# EAGLE design cc2652p2-tcp (EAGLE 9.6.2)
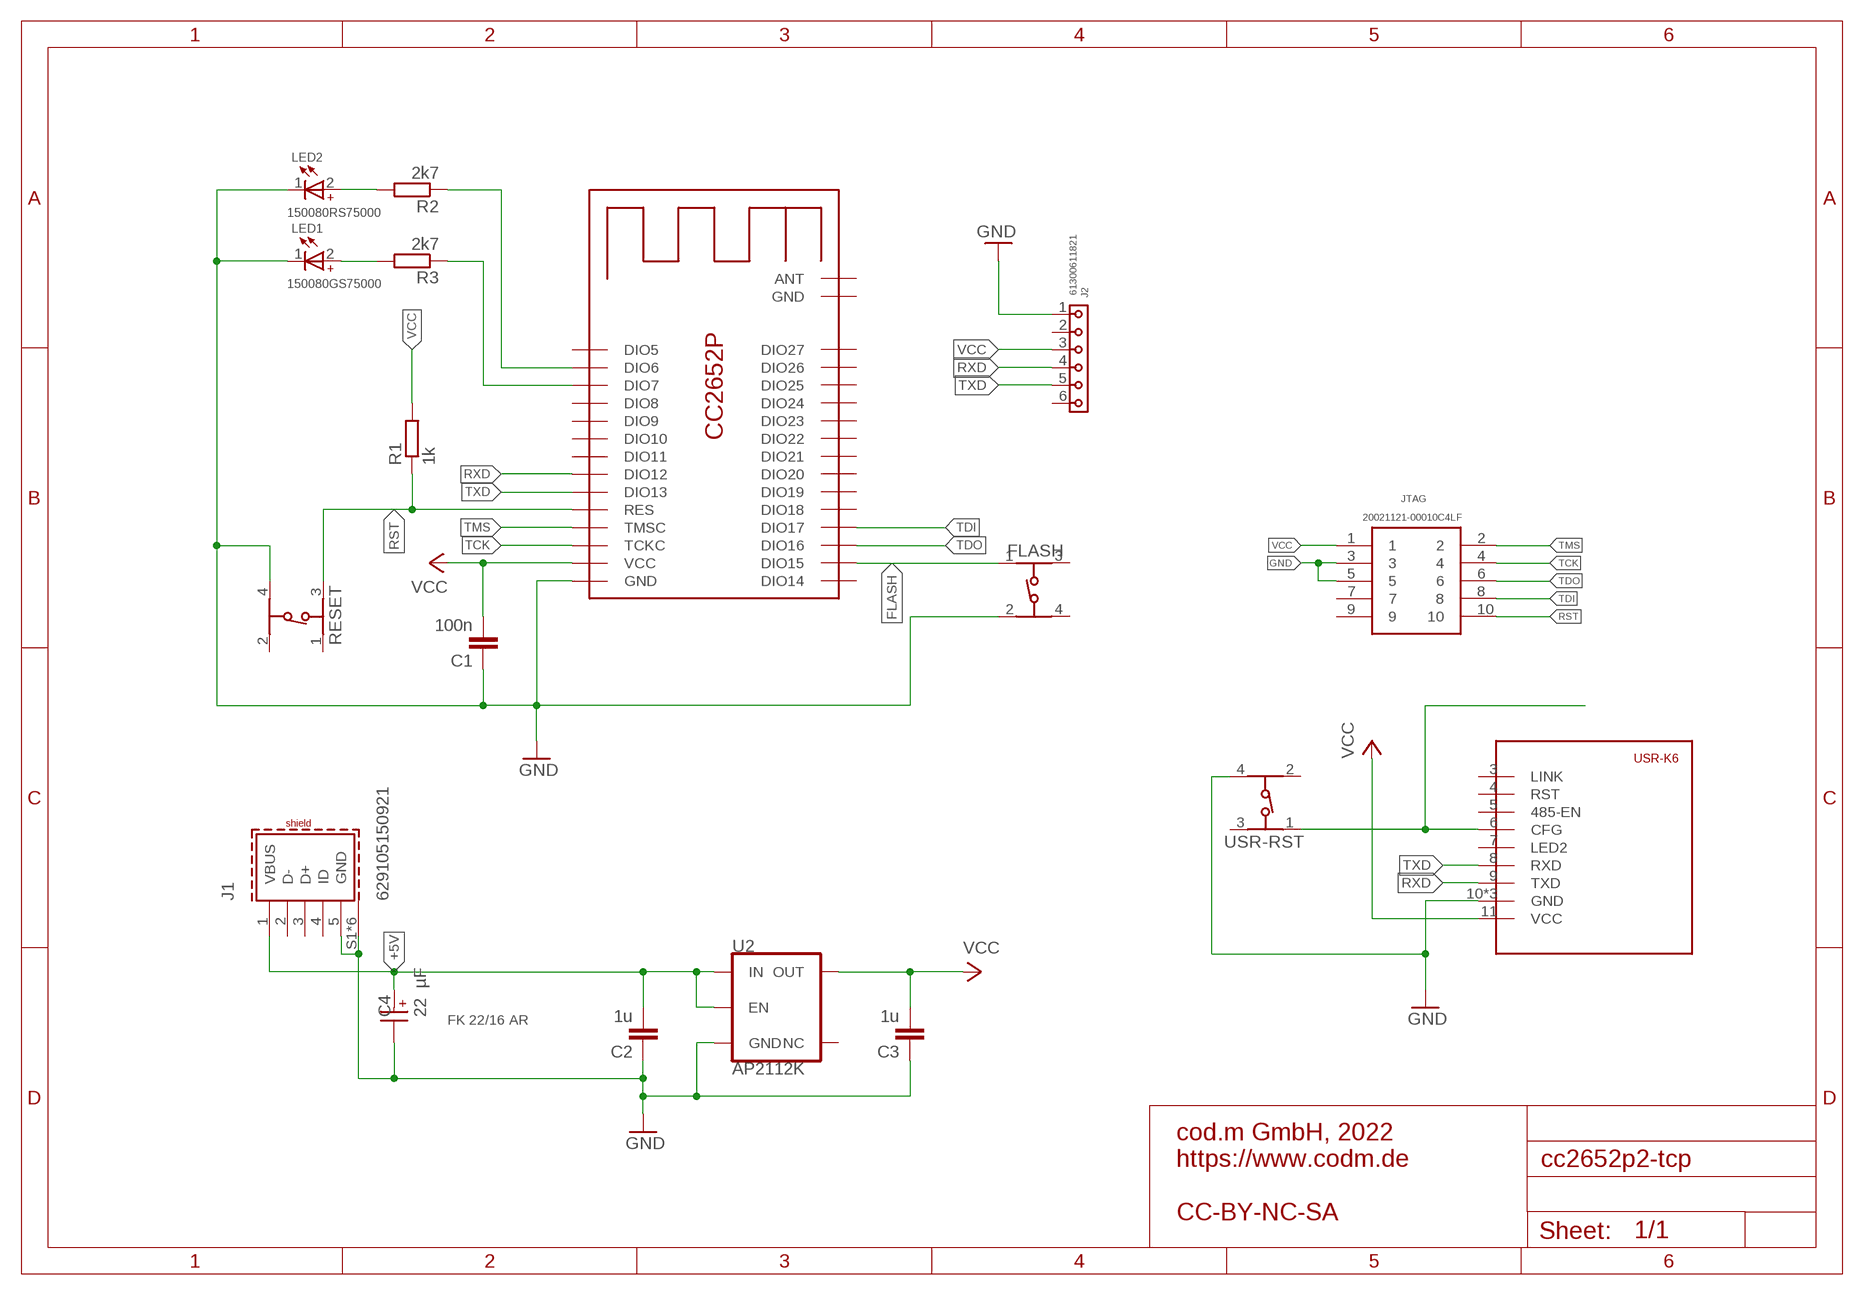
[diagram p0: schematic, sheet 1]

## Parts
C1  100n  C-EUC0805  [C0805]
C2  1u  C-EUC0805  [C0805]
C3  1u  C-EUC0805  [C0805]
C4  22 µF  WCAP-ASLL_5X5.5_865060342002  [WCAP-ASLL_5X5.5(DXL)]
FLASH  434153017835  [434153017835]
J1  629105150921  [629105150921]
J2  61300611821  6130XX11821_61300611821  [61300611821]
JTAG  20021121-00010C4LF  [2002112100010C4LF]
LED1  150080GS75000  WL-SMCW_0805_150080GS75000  [WL-SMCW_0805]
LED2  150080RS75000  WL-SMCW_0805_150080RS75000  [WL-SMCW_0805]
R1  1k  R-EU_R0805  [R0805]
R2  2k7  R-EU_R0805  [R0805]
R3  2k7  R-EU_R0805  [R0805]
RESET  434153017835  [434153017835]
U1  CC2652P2-DUOWEISI  [CC2652P2-DUOWEISI]
U2  AP2112K  V_REG_AP2112K-3.3V  [SOT23-5]
U3  USR-K6  [USR-K6]
USR-RST  434153017835  [434153017835]

## Nets
+5V: C2.2 C4.1(+) J1.1(VBUS) U2.1(IN) U2.3(EN)
FLASH: FLASH.1 U1.DIO15
GND: C1.1 C2.1 C3.1 C4.2(-) FLASH.2 J1.5(GND) J1.S1(SHIELD) J1.S2(SHIELD) J1.S3(SHIELD) J1.S4(SHIELD) J1.S5(SHIELD) J1.S6(SHIELD) J2.1 JTAG.3 JTAG.5 LED1.1(-) LED2.1(-) RESET.4 U1.GND U2.2(GND) U3.10(GND) U3.GND@1(GND) U3.GND@2(GND) USR-RST.4
N$1: U3.6(CFG) USR-RST.1
N$2: R3.1 U1.DIO7
N$3: R2.1 U1.DIO6
N$4: LED2.2(+) R2.2
N$5: LED1.2(+) R3.2
RST: JTAG.10 R1.1 RESET.3 U1.RES
RXD: J2.4 U1.DIO12 U3.9(TXD)
TCK: JTAG.4 U1.TCKC
TDI: JTAG.8 U1.DIO17
TDO: JTAG.6 U1.DIO16
TMS: JTAG.2 U1.TMSC
TXD: J2.5 U1.DIO13 U3.8(RXD)
VCC: C1.2 C3.2 J2.3 JTAG.1 R1.2 U1.VCC U2.5(OUT) U3.11(VCC)
Unconnected: FLASH.3 FLASH.4 J1.2(D-) J1.3(D+) J1.4(ID) J2.2 J2.6 JTAG.7 JTAG.9 RESET.1 RESET.2 U1.ANT U1.DIO5 U1.DIO8 U1.DIO9 U1.DIO10 U1.DIO11 U1.DIO14 U1.DIO18 U1.DIO19 U1.DIO20 U1.DIO21 U1.DIO22 U1.DIO23 U1.DIO24 U1.DIO25 U1.DIO26 U1.DIO27 U1.GND@1(GND) U2.4(NC) U3.3(LINK) U3.4(RST) U3.5(485-EN) U3.7(LED2) USR-RST.2 USR-RST.3

## Notes on the sheet
- FK 22/16 AR
- cod.m GmbH, 2022
  https://www.codm.de
  
  CC-BY-NC-SA

## Library data of the parts
C1-C3 = rcl:C-EU: CAPACITOR, European symbol; SPICEPREFIX: C
C4 = Eagle_WCAP-ASLL (rev20a):WCAP-ASLL_5X5.5: WCAP-ASLL Aluminium Electrolytic Capacitors Low Impedance & Long Life +105 °C Characteristics Low impedance and long life product series Mounting style: V-Chip SMT Capacitance range: 1 µF ‒ 6800 µF Capacitance tolerance: ±20 % Voltage range (UR): 6.3 ‒ 450 V(DC) Operating temperature: -55 °C up to +105 °C for UR ≤ 100 V(DC) -40 °C up to +105 °C for UR > 100 V(DC) Endurance: 2000 ‒ 5000 h @ +105 °C Dimensions (DxL) in mm: 4.0 x 5.5 up to 16.0 x 17.0 Recommended soldering: Reflow soldering Applications Long life application & low impedance Input and output capacitor for switched-mode power supply Filtering Smoothing e.g. DC/DC converter, AC/DC converter, satellite receiver, control panel <https://www.we-online.com/catalog/media/o14724v209%20Family_WCAP-ASLL.jpg> Details see: https://www.we-online.com/catalog/en/WCAP-ASLL/ Updated by yingchun,Shan;2020-03-03 2020(C) Würth Elektronik; DATASHEET-URL: https://www.we-online.com/catalog/datasheet/865060342002.pdf; DF: 16%; DIAMETER: 5mm; I-LEAK: 3.52uA; I-RIPPLE: 150mA; L: 5.5mm; OPERATING-TEMPERATURE: -55 °C up to +105 °C; PART-NUMBER: 865060342002; TECHNICAL-REFERENCE: ASEC055220M016DVCTBB000; VR: 16V(DC); Z: 0.8Ohm
FLASH RESET USR-RST = 434153017835_Eagle_WS-TASV_rev20a:434153017835: WS-TASV J-Bend SMT Tact Switch 3.5x2.9 mm Material Properties Cover Material : Stainless Steel Properties Actuator Material:LCP Actuator Flammability Rating:UL94 V-0 Actuator Color:Blue Frame Material:PA46 Frame Flammability Rating:UL94 HB Frame Color:Black Contact Material:Stainless Steel Contact Plating:Silver Terminal Material:Copper Alloy Terminal Plating:Silver VR:12 V (DC) Contact Resistance Initial:100 mΩ Contact Resistance After Life Test:1 Ω RISO:100 MΩ Withstanding Voltage:250 V (AC) Washable:No Qty.:4000 Mechanical Properties Stroke :0.15 mm General Information Operating Temperature:-40 up to +85 °C Washable:No Packaging Properties Packaging:Tape and Reel <https://www.we-online.com/catalog/media/o72753v209%20WS-TASU_434331013822_a_4C.jpg> Details see: https://www.we-online.com/catalog/en/TASV_3_5X2_9_SMD_J-BEND/ Updated by yingchun,Shan;2020-02-18 2020(C) Würth Elektronik; DATASHEET-URL: https://www.we-online.com/catalog/datasheet/434153017835.pdf; H: 1.7mm; OPERATION-FORCE: 350g; PART-NUMBER: 434153017835; QTY: 4000
J1 = codm:629105150921: WR-COM Micro USB 2.0 Type AB Horizontal Kind Properties Durability:10 000 Mating cycles Connector Type:Micro USB Gender:Receptacle Type:Horizontal General Information Operating Temperature:-40up to +85 °C Electrical Properties Working Voltage:30V (AC) Withstanding Voltage:100V (AC) Contact Resistance:30 mΩ Material Properties Insulator Material:LCP Insulator Flammability Rating:UL94 V-0 Color:Black Contact Material:Copper Alloy Contact Plating: Gold Contact Type:Stamped Shielding Material:Stainless Steel Shielding Plating:Matte Tin <https://www.we-online.com/catalog/media/o33046v209%20Family_WR-COM_Micro_USB_629105150921.jpg> Details see: https://www.we-online.com/catalog/en/COM_MICRO_2_0_TYPE_AB_HORIZONTAL/ Updated by Ella Wu 2021-11-04 2021 (C) Würth Elektronik; APPLICATION: Micro USB 2.0; DATASHEET-URL: https://www.we-online.com/catalog/datasheet/629105150921.pdf; GERDER: Receptacle; INTERFACE-TYPE: Type AB; IR1: 1.8A; MOUNT: SMT; PACKAGING: Tape and Reel; PART-NUMBER: 629105150921; PINS: 5; TYPE: Horizontal; WORKING-VOLTAGE: 30V(AC)
J2 = Eagle_WR-PHD (rev21a):6130XX11821_61300611821: WR-PHD 2.54 mm Socket Header ARTICLE PROPERTIES: Pins:1;​ 2;​ 3;​ 4;​ 5;​ 6;​ 7;​ 8;​ 9;​ 10;​ 12;​ 13;​ 14;​ 15;​ 16;​ 18;​ 20;​ 22;​ 24;​ 25;​ 32;​ 36;​ 40 KIND PROPERTIES: Pitch：2.54 mm Quality Class:3 as per CECC 75 301-802 Rows：Single Gender：Socket Header;​ Female Type：Straight MATERIAL PROPERTIES: Insulator Material :PBT Insulator Flammability Rating:UL94 V-0 Contact Material:Copper Alloy Contact Plating:Gold Contact Type:Stamped GENERAL INFORMATION Operating Temperature:-40 up to +125 °C Compliance:Lead free / RoHS ELECTRICAL PROPERTIES: Rated Current:3 A IR 1:3 A Withstanding Voltage:500 V (AC) Contact Resistance:20 mΩ RISO:1000 MΩ CERTIFICATION UL Approval:E323964 PACKAGING PROPERTIES Packaging:Tray <https://katalog.we-online.com/media/images/v2/o33218v209%20Family_WR-PHD_613xxx11821.jpg> Details see: https://katalog.we-online.com/en/em/PHD_2_54_SOCKET_HEADER_6130XX11821 Updated by Yingchun,Shan 2019-10-21 2019 (C) Würth Elektronik; DATASHEET-URL: https://www.we-online.com/catalog/datasheet/61300611821.pdf; GENDER: Socket Header; IR: 3A; MOUNT: THT; PACKAGING: Tray; PART-NUMBER: 61300611821; PINS: 6; PITCH: 2.54mm; ROWS: Single; TYPE: Straight
JTAG = 20021121-00010C4LF:20021121-00010C4LF: Headers & Wire Housings 1.27x1.27mm BTB, Hdr Unshrd, SMT, 10 Pos Source: Datasheet; DESCRIPTION: Headers & Wire Housings 1.27x1.27mm BTB, Hdr Unshrd, SMT, 10 Pos; HEIGHT: 4.55mm; MANUFACTURER_NAME: Amphenol; MANUFACTURER_PART_NUMBER: 20021121-00010C4LF; MOUSER_PART_NUMBER: 649-202112100010C4LF; MOUSER_PRICE-STOCK: https://www.mouser.com/Search/Refine.aspx?Keyword=649-202112100010C4LF
LED1 = Eagle_WL-SMCW (rev22a):WL-SMCW_0805: WL-SMCW SMT Mono-color Chip LED Waterclea Characteristics Low energy consumption High reliability Low current requirement Fast switching No UV/IR radiation Smallest SMD LED package for exceptional brightness Top view LED Wide viewing angle Better solder ability Heat dissipation Applications Backlight for mobile and portable device keypads Indoor and outdoor message boards Flat backlight for LCDs, switches and symbols Display for industrial control systems and traffic Miniaturized color effects Pedestrian mark Optical indicators Tabular backlight: LCD, telephone key-press, power-switch, display board Indoor displays Signals Identifiers Backlight for automobile DVD LED General lighting Toys <https://www.we-online.com/catalog/media/o14904v209%20Family_WL-SMCW.jpg> Details see: https://www.we-online.com/catalog/en/WL-SMCW/ Updated BY Yingchun,Shan 2020-03-18 2020(C) Wurth Elektronik; CHIP-TECHNOLOGY: InGaN; DATASHEET-URL: https://www.we-online.com/catalog/datasheet/150080GS75000.pdf; DOMINANT-WAVELENGTH: 525nm; EMITTING-COLOR: Green; FORWARD-VOLTAGE: 140°; LUMINOUS-INTENSITY: 450mcd; PART-NUMBER: 150080GS75000; PEAK-WAVELENGTH: 515nm
LED2 = Eagle_WL-SMCW (rev22a):WL-SMCW_0805: WL-SMCW SMT Mono-color Chip LED Waterclea Characteristics Low energy consumption High reliability Low current requirement Fast switching No UV/IR radiation Smallest SMD LED package for exceptional brightness Top view LED Wide viewing angle Better solder ability Heat dissipation Applications Backlight for mobile and portable device keypads Indoor and outdoor message boards Flat backlight for LCDs, switches and symbols Display for industrial control systems and traffic Miniaturized color effects Pedestrian mark Optical indicators Tabular backlight: LCD, telephone key-press, power-switch, display board Indoor displays Signals Identifiers Backlight for automobile DVD LED General lighting Toys <https://www.we-online.com/catalog/media/o14904v209%20Family_WL-SMCW.jpg> Details see: https://www.we-online.com/catalog/en/WL-SMCW/ Updated BY Yingchun,Shan 2020-03-18 2020(C) Wurth Elektronik; CHIP-TECHNOLOGY: AlInGaP; DATASHEET-URL: https://www.we-online.com/catalog/datasheet/150080RS75000.pdf; DOMINANT-WAVELENGTH: 625nm; EMITTING-COLOR: Red; FORWARD-VOLTAGE: 140°; LUMINOUS-INTENSITY: 150mcd; PART-NUMBER: 150080RS75000; PEAK-WAVELENGTH: 630nm
R1-R3 = rcl:R-EU_: RESISTOR, European symbol; SPICEPREFIX: R
U1 = codm:CC2652P2-DUOWEISI
U2 = SparkFun-IC-Power:V_REG_AP2112: AP2112 - 600mA CMOS LDO Regulator w/ Enable The AP2112 is CMOS process low dropout linear regulator with enable function, the regulator delivers a guaranteed 600mA (min.) continuous load current. Features Output Voltage Accuracy: ±1.5% Output Current: 600mA (Min.) Foldback Short Current Protection: 50mA Enable Function to Turn ON/OFF VOUT Low Dropout Voltage (3.3V): 250mV (Typ.) @IOUT=600mA Excellent Load Regulation: 0.2%/A (Typ.) Excellent Line Regulation: 0.02%/V (Typ.) Low Quiescent Current: 55μA (Typ.) Low Standby Current: 0.01μA (Typ.) Low Output Noise: 50μVRMS PSRR: 100Hz -65dB, 1kHz -65dB OTSD Protection Stable with 1.0μF Flexible Cap: Ceramic, Tantalum and Aluminum Electrolytic Operation Temperature Range: -40°C to 85°C ESD: MM 400V, HBM 4000V; PROD_ID: VREG-12457; VALUE: 3.3V
U3 = codm:USR-K6

## Board
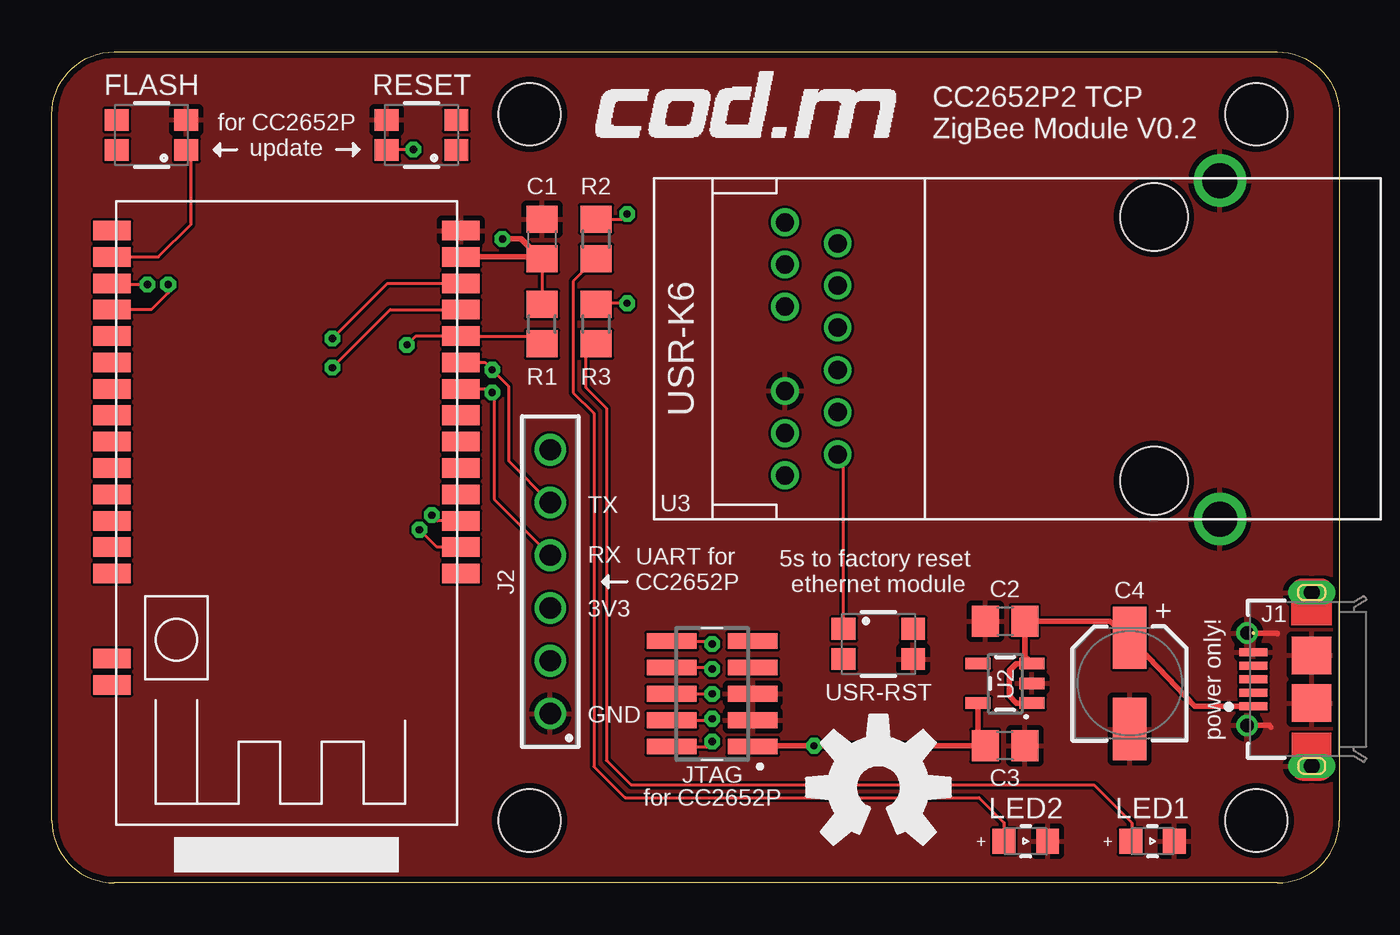
[diagram p1: board, top side]
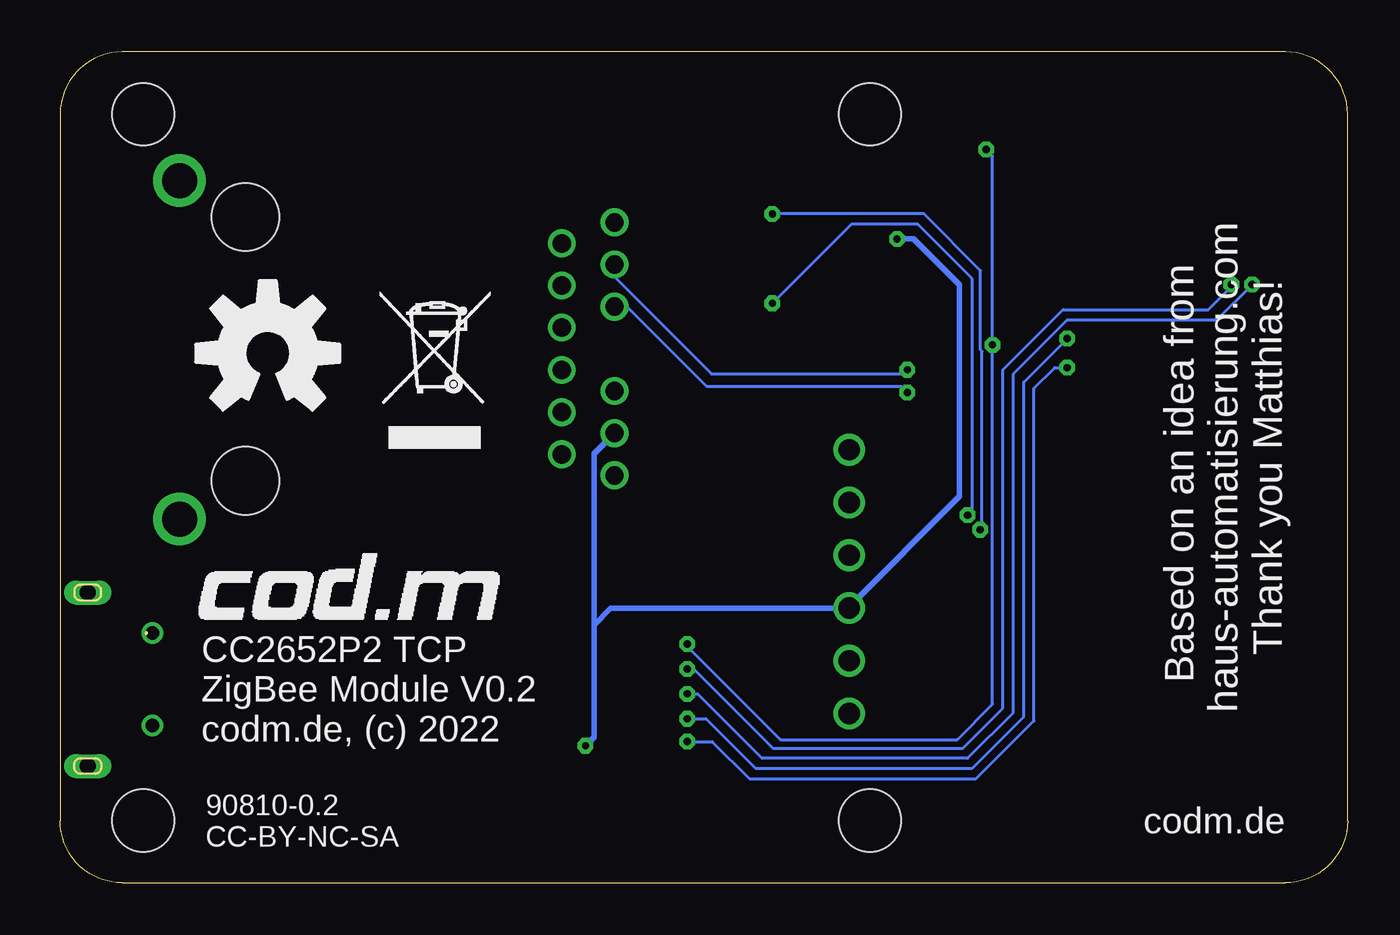
[diagram p2: board, bottom side, seen from below]

Size 62 x 40 mm. Coordinates in mm from the lower left corner, seen from the top.
Outline: 0,3 0,37 arc-90 3,40 59,40 arc-90 62,37 62,3 arc-90 59,0 3,0 arc-90 0,3
Copper layers (1*16): Top 0.035mm / dielectric 1.5mm / Bottom 0.035mm
Design rules "aisler_2_layer_complex": minimum track width 0.125mm, minimum drill 0.2mm, track to track 0.125mm, track to pad 0.125mm, pad to pad 0.125mm, via to via 0.125mm, smd to smd 0.125mm, copper to edge 0.3mm, drill to drill 0.25mm, minimum pad ring 0.2mm, minimum via ring 0.2mm, stop-mask expansion 0mil, vias tented up to drill 0mil, thermal gap 10mil
Holes 3 mm at 23,37 23,3 58,37 58,3

### Footprints (pad centres in the part's own frame; a part is rotated, then mirrored left to right if it is on the bottom)
C0805 = smd 1.3 x 1.5: 1 -0.95,0; 2 0.95,0
WCAP-ASLL_5X5.5(DXL) = smd 3 x 1.6: 1 2.2,0; 2 -2.2,0
434153017835 = smd 1.15 x 1.05: 1 -1.675,0.725; 2 -1.675,-0.725; 3 1.675,0.725; 4 1.675,-0.725
629105150921 = smd 0.4 x 1.35: 1 -1.3,2.335; 2 -0.65,2.335; 3 0,2.335; 4 0.65,2.335; 5 1.3,2.335 | drill 0.65 pad 1.05: S1 -2.225,2.65; S2 2.225,2.65 | drill 0.75 pad 0.95 long: S3 -4.175,-0.47; S6 4.175,-0.47 | smd 1.8 x 1.9: S4 -1.15,-0.47; S5 1.15,-0.47
61300611821 = drill 1.02: 1 -6.35,0; 2 -3.81,0; 3 -1.27,0; 4 1.27,0; 5 3.81,0; 6 6.35,0
2002112100010C4LF = smd 0.76 x 2.4: 1 -2.54,-1.95; 2 -2.54,1.95; 3 -1.27,-1.95; 4 -1.27,1.95; 5 0,-1.95; 6 0,1.95; 7 1.27,-1.95; 8 1.27,1.95; 9 2.54,-1.95; 10 2.54,1.95
WL-SMCW_0805 = smd 1.1 x 1.2: 1 -1.05,0; 2 1.05,0
R0805 = smd 1.3 x 1.5: 1 -0.95,0; 2 0.95,0
CC2652P2-DUOWEISI = smd 1.8 x 0.94: ANT 16.6,23.27; DIO5 -0.2,17.91; DIO6 -0.2,16.64; DIO7 -0.2,15.37; DIO8 -0.2,14.1; DIO9 -0.2,12.83; DIO10 -0.2,11.56; DIO11 -0.2,10.29; DIO12 -0.2,9.02; DIO13 -0.2,7.75; DIO14 16.6,1.4; DIO15 16.6,2.67; DIO16 16.6,3.94; DIO17 16.6,5.21; DIO18 16.6,6.48; DIO19 16.6,7.75; DIO20 16.6,9.02; DIO21 16.6,10.29; DIO22 16.6,11.56; DIO23 16.6,12.83; DIO24 16.6,14.1; DIO25 16.6,15.37; DIO26 16.6,16.64; DIO27 16.6,17.91; GND -0.2,1.4; GND@1 16.6,22; RES -0.2,6.48; TCKC -0.2,3.94; TMSC -0.2,5.21; VCC -0.2,2.67
SOT23-5 = smd 0.55 x 1.2: 1 -0.95,-1.3; 2 0,-1.3; 3 0.95,-1.3; 4 0.95,1.3; 5 -0.95,1.3
USR-K6 = drill 0.89: 1 8.841,13.288; 2 8.841,11.258; 3 8.841,9.228; 4 8.841,7.188; 5 8.841,5.158; 6 8.841,3.128; 7 6.301,14.298; 8 6.301,12.268; 9 6.301,10.238; 10 6.301,6.178; 11 6.301,4.148; 12 6.301,2.118 | drill 1.68: GND@1 27.251,0.008; GND@2 27.251,16.308 | hole 3.25: 24.071,14.558; 24.071,1.858

### Placement (x,y rotation side)
C1  23.6,31 270 top
C2  45.9,12.6 0 top
C3  45.9,6.6 180 top
C4  51.9,9.6 90 top
FLASH  4.8,36 180 top
J1  60.2,9.8 90 top
J2  24,14.5 90 top
JTAG  31.8,9.1 90 top
LED1  53,2 180 top
LED2  46.9,2 180 top
R1  23.6,26.9 90 top
R2  26.2,31 270 top
R3  26.2,26.9 270 top
RESET  17.8,36 180 top
U1  19.5,32.8 180 top
U2  45.9,9.6 90 top
U3  29,17.5 0 top
U$1  [CODM-LOGO]  26.2,35.9 0 top
U$2  [CODM-LOGO]  55.3,12.7 0 bottom
U$4  [OSHW-LOGO-L]  39.8,4.6 0 top
U$5  [OSHW-LOGO-L]  52,25.5 0 bottom
U$6  [WEEE-LOGO-5MM]  46.6,20.9 0 bottom
USR-RST  39.8,11.5 0 top

### Tracks (layer width: path | path; a pad name or v marks a point on that pad's centre or on a via)
+5V
  Top 0.254: U2.1 46.45,8.65 46.1,9 46.1,10.2 46.45,10.55 U2.3 46.85,10.9 C2.2 50.95,12.6 C4.1 55.05,8.5 J1.1
FLASH
  Top 0.152: U1.DIO15 5.13,30.13 6.7,31.7 6.7,35.25 FLASH.1
GND
  Top 0.254: J1.S2 58.98,12.03 59,12 | J1.S1 58.62,7.58 58.7,7.5
  pour Top: 0,0 0,40 64,40 64,0
N$1
  Top 0.152: USR-RST.1 38.12,20.34 U3.6
N$2  (via drill 0.35)
  Top 0.152: U1.DIO7 18.57,17.43 v18.3,17.7 | v27.7,27.9 26.25,27.9 R3.1
  Bottom 0.152: v18.3,17.7 18.1,17.9 18.1,29.1 20.7,31.7 23.9,31.7 v27.7,27.9
N$3  (via drill 0.35)
  Top 0.152: U1.DIO6 18.54,16.16 v17.7,17 | R2.1 27.45,31.95 v27.7,32.2
  Bottom 0.152: v17.7,17 17.6,17.1 17.6,25.59 17.68,25.66 17.68,29.48 20.4,32.2 v27.7,32.2
N$4
  Top 0.152: R2.2 25.1,28.95 25.1,23.6 26.1,22.6 26.1,5.6 27.6,4.1 44.65,4.1 45.85,2.9 LED2.2
N$5
  Top 0.152: R3.2 25.7,25.45 25.7,23.85 26.7,22.85 26.7,5.9 27.9,4.7 50.2,4.7 52,2.9 52,2.05 LED1.2
RST  (via drill 0.35)
  Top 0.152: v17.1,25.9 17.52,26.32 U1.RES 22.93,26.32 R1.1 | JTAG.10 31.66,11.64 v31.8,11.5 | v17.4,35.3 16.15,35.3 RESET.3
  Bottom 0.152: v17.4,35.3 17.1,35 v17.1,25.9 17.1,8.6 18.8,6.9 27.3,6.9 31.8,11.4 v31.8,11.5
RXD  (via drill 0.35)
  Top 0.152: U1.DIO12 21.02,23.78 v21.2,23.6 21.3,23.5 21.3,18.47 J2.4
  Bottom 0.152: U3.9 34.7,27.74 30.86,23.9 21.5,23.9 v21.2,23.6
TCK  (via drill 0.35)
  Top 0.152: JTAG.4 31.73,7.83 v31.8,7.9 | v13.5,26.2 16.16,28.86 U1.TCKC
  Bottom 0.152: v13.5,26.2 15.6,24.1 15.6,8 18.1,5.5 28.5,5.5 30.9,7.9 v31.8,7.9
TDI  (via drill 0.35)
  Top 0.152: JTAG.8 31.73,10.37 v31.8,10.3 | v5.6,28.8 5.6,28.4 4.79,27.59 U1.DIO17
  Bottom 0.152: v5.6,28.8 5.6,28.7 6.7,27.6 13.7,27.6 16.6,24.7 16.6,8.4 18.53,6.47 27.66,6.47 31.49,10.3 v31.8,10.3
TDO  (via drill 0.35)
  Top 0.152: JTAG.6 v31.8,9.1 | v4.6,28.8 2.96,28.8 U1.DIO16
  Bottom 0.152: v4.6,28.8 6.3,27.1 13.5,27.1 16.1,24.5 16.1,8.2 18.31,5.99 28.19,5.99 31.3,9.1 v31.8,9.1
TMS  (via drill 0.35)
  Top 0.152: JTAG.2 31.56,6.56 v31.8,6.8 | v13.5,24.8 16.29,27.59 U1.TMSC
  Bottom 0.152: v13.5,24.8 14.1,24.8 15.1,23.8 15.1,7.8 17.9,5 28.8,5 30.6,6.8 v31.8,6.8
TXD  (via drill 0.35)
  Top 0.152: U1.DIO13 20.85,25.05 v21.2,24.7 22,23.9 22,20.31 J2.5
  Bottom 0.152: U3.8 35.3,29.17 30.63,24.5 21.4,24.5 v21.2,24.7
VCC  (via drill 0.35)
  Top 0.152: C1.2 23.6,30 R1.2
  Top 0.254: U1.VCC 23.52,30.13 C1.2 | U2.5 44.6,7.15 C3.2 v36.7,6.6 33.79,6.6 JTAG.1 | 23.6,30 22.6,31 v21.7,31
  Bottom 0.254: U3.11 36.3,20.65 36.3,12.4 | v36.7,6.6 36.3,7 36.3,12.4 | J2.3 24,13.3 | 24,13.3 24.09,13.21 35.48,13.21 36.3,12.4 | 24,13.3 18.7,18.6 18.7,28.8 20.9,31 v21.7,31

### Text on the board
tNames: CC2652P2 TCP / ZigBee Module V0.2 | for CC2652P / update | TX | RX | UART for / CC2652P | 5s to factory reset / ethernet module | 3V3 | power only! | GND | for CC2652P
bNames: Based on an idea from / haus-automatisierung.com / Thank you Matthias! | CC2652P2 TCP / ZigBee Module V0.2 / codm.de, (c) 2022 | codm.de | 90810-0.2 / CC-BY-NC-SA
tStop: CC-BY-NC-SA